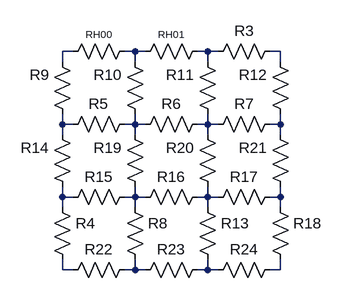
[diagram p0: schematic Draft1.asc]
Draft1.asc, the LTspice schematic file:
Version 4
SHEET 1 880 680
WIRE 0 96 -16 96
WIRE 96 96 80 96
WIRE 112 96 96 96
WIRE 208 96 192 96
WIRE 224 96 208 96
WIRE 320 96 304 96
WIRE -16 112 -16 96
WIRE 96 112 96 96
WIRE 208 112 208 96
WIRE 320 112 320 96
WIRE -16 208 -16 192
WIRE 0 208 -16 208
WIRE 96 208 96 192
WIRE 96 208 80 208
WIRE 112 208 96 208
WIRE 208 208 208 192
WIRE 208 208 192 208
WIRE 224 208 208 208
WIRE 320 208 320 192
WIRE 320 208 304 208
WIRE -16 224 -16 208
WIRE 96 224 96 208
WIRE 208 224 208 208
WIRE 320 224 320 208
WIRE -16 320 -16 304
WIRE 0 320 -16 320
WIRE 96 320 96 304
WIRE 96 320 80 320
WIRE 112 320 96 320
WIRE 208 320 208 304
WIRE 208 320 192 320
WIRE 224 320 208 320
WIRE 320 320 320 304
WIRE 320 320 304 320
WIRE -16 336 -16 320
WIRE 96 336 96 320
WIRE 208 336 208 320
WIRE 320 336 320 320
WIRE -16 432 -16 416
WIRE 0 432 -16 432
WIRE 96 432 96 416
WIRE 96 432 80 432
WIRE 112 432 96 432
WIRE 208 432 208 416
WIRE 208 432 192 432
WIRE 224 432 208 432
WIRE 320 432 320 416
WIRE 320 432 304 432
SYMBOL res 96 80 R90
WINDOW 0 0 56 VBottom 1
WINDOW 3 32 56 VTop 2
SYMATTR InstName RH00
SYMATTR Value ""
SYMBOL res 208 80 R90
WINDOW 0 0 56 VBottom 1
WINDOW 3 32 56 VTop 2
SYMATTR InstName RH01
SYMATTR Value ""
SYMBOL res 320 80 R90
WINDOW 0 0 56 VBottom 2
WINDOW 3 32 56 VTop 2
SYMATTR InstName R3
SYMATTR Value ""
SYMBOL res 0 208 R180
WINDOW 0 36 76 Left 2
WINDOW 3 36 40 Left 2
SYMATTR InstName R9
SYMATTR Value ""
SYMBOL res 112 208 R180
WINDOW 0 36 76 Left 2
WINDOW 3 36 40 Left 2
SYMATTR InstName R10
SYMATTR Value ""
SYMBOL res 224 208 R180
WINDOW 0 36 76 Left 2
WINDOW 3 36 40 Left 2
SYMATTR InstName R11
SYMATTR Value ""
SYMBOL res 336 208 R180
WINDOW 0 36 76 Left 2
WINDOW 3 36 40 Left 2
SYMATTR InstName R12
SYMATTR Value ""
SYMBOL res 0 320 R180
WINDOW 0 36 76 Left 2
WINDOW 3 36 40 Left 2
SYMATTR InstName R14
SYMATTR Value ""
SYMBOL res -16 336 R270
WINDOW 0 32 56 VTop 2
WINDOW 3 0 56 VBottom 2
SYMATTR InstName R15
SYMATTR Value ""
SYMBOL res 96 336 R270
WINDOW 0 32 56 VTop 2
WINDOW 3 0 56 VBottom 2
SYMATTR InstName R16
SYMATTR Value ""
SYMBOL res 208 336 R270
WINDOW 0 32 56 VTop 2
WINDOW 3 0 56 VBottom 2
SYMATTR InstName R17
SYMATTR Value ""
SYMBOL res 96 192 R90
WINDOW 0 0 56 VBottom 2
WINDOW 3 32 56 VTop 2
SYMATTR InstName R5
SYMATTR Value ""
SYMBOL res 208 192 R90
WINDOW 0 0 56 VBottom 2
WINDOW 3 32 56 VTop 2
SYMATTR InstName R6
SYMATTR Value ""
SYMBOL res 320 192 R90
WINDOW 0 0 56 VBottom 2
WINDOW 3 32 56 VTop 2
SYMATTR InstName R7
SYMATTR Value ""
SYMBOL res 112 320 R180
WINDOW 0 36 76 Left 2
WINDOW 3 36 40 Left 2
SYMATTR InstName R19
SYMATTR Value ""
SYMBOL res 224 320 R180
WINDOW 0 36 76 Left 2
WINDOW 3 36 40 Left 2
SYMATTR InstName R20
SYMATTR Value ""
SYMBOL res 336 320 R180
WINDOW 0 36 76 Left 2
WINDOW 3 36 40 Left 2
SYMATTR InstName R21
SYMATTR Value ""
SYMBOL res -32 320 R0
SYMATTR InstName R4
SYMATTR Value ""
SYMBOL res 80 320 R0
SYMATTR InstName R8
SYMATTR Value ""
SYMBOL res 192 320 R0
SYMATTR InstName R13
SYMATTR Value ""
SYMBOL res 304 320 R0
SYMATTR InstName R18
SYMATTR Value ""
SYMBOL res 96 416 R90
WINDOW 0 0 56 VBottom 2
WINDOW 3 32 56 VTop 2
SYMATTR InstName R22
SYMATTR Value ""
SYMBOL res 208 416 R90
WINDOW 0 0 56 VBottom 2
WINDOW 3 32 56 VTop 2
SYMATTR InstName R23
SYMATTR Value ""
SYMBOL res 320 416 R90
WINDOW 0 0 56 VBottom 2
WINDOW 3 32 56 VTop 2
SYMATTR InstName R24
SYMATTR Value ""

The netlist it stands for:
* Draft1.asc
RH00 N002 N001
RH01 N003 N002
R3 N004 N003
R9 N005 N001
R10 N006 N002
R11 N007 N003
R12 N008 N004
R14 N009 N005
R15 N009 N010
R16 N010 N011
R17 N011 N012
R5 N006 N005
R6 N007 N006
R7 N008 N007
R19 N010 N006
R20 N011 N007
R21 N012 N008
R4 N009 N013
R8 N010 N014
R13 N011 N015
R18 N012 N016
R22 N014 N013
R23 N015 N014
R24 N016 N015
.backanno
.end